# Altium schematic sheet MC_LV.SchDoc
size A2; SheetNumber: 1; SheetTotal: 1
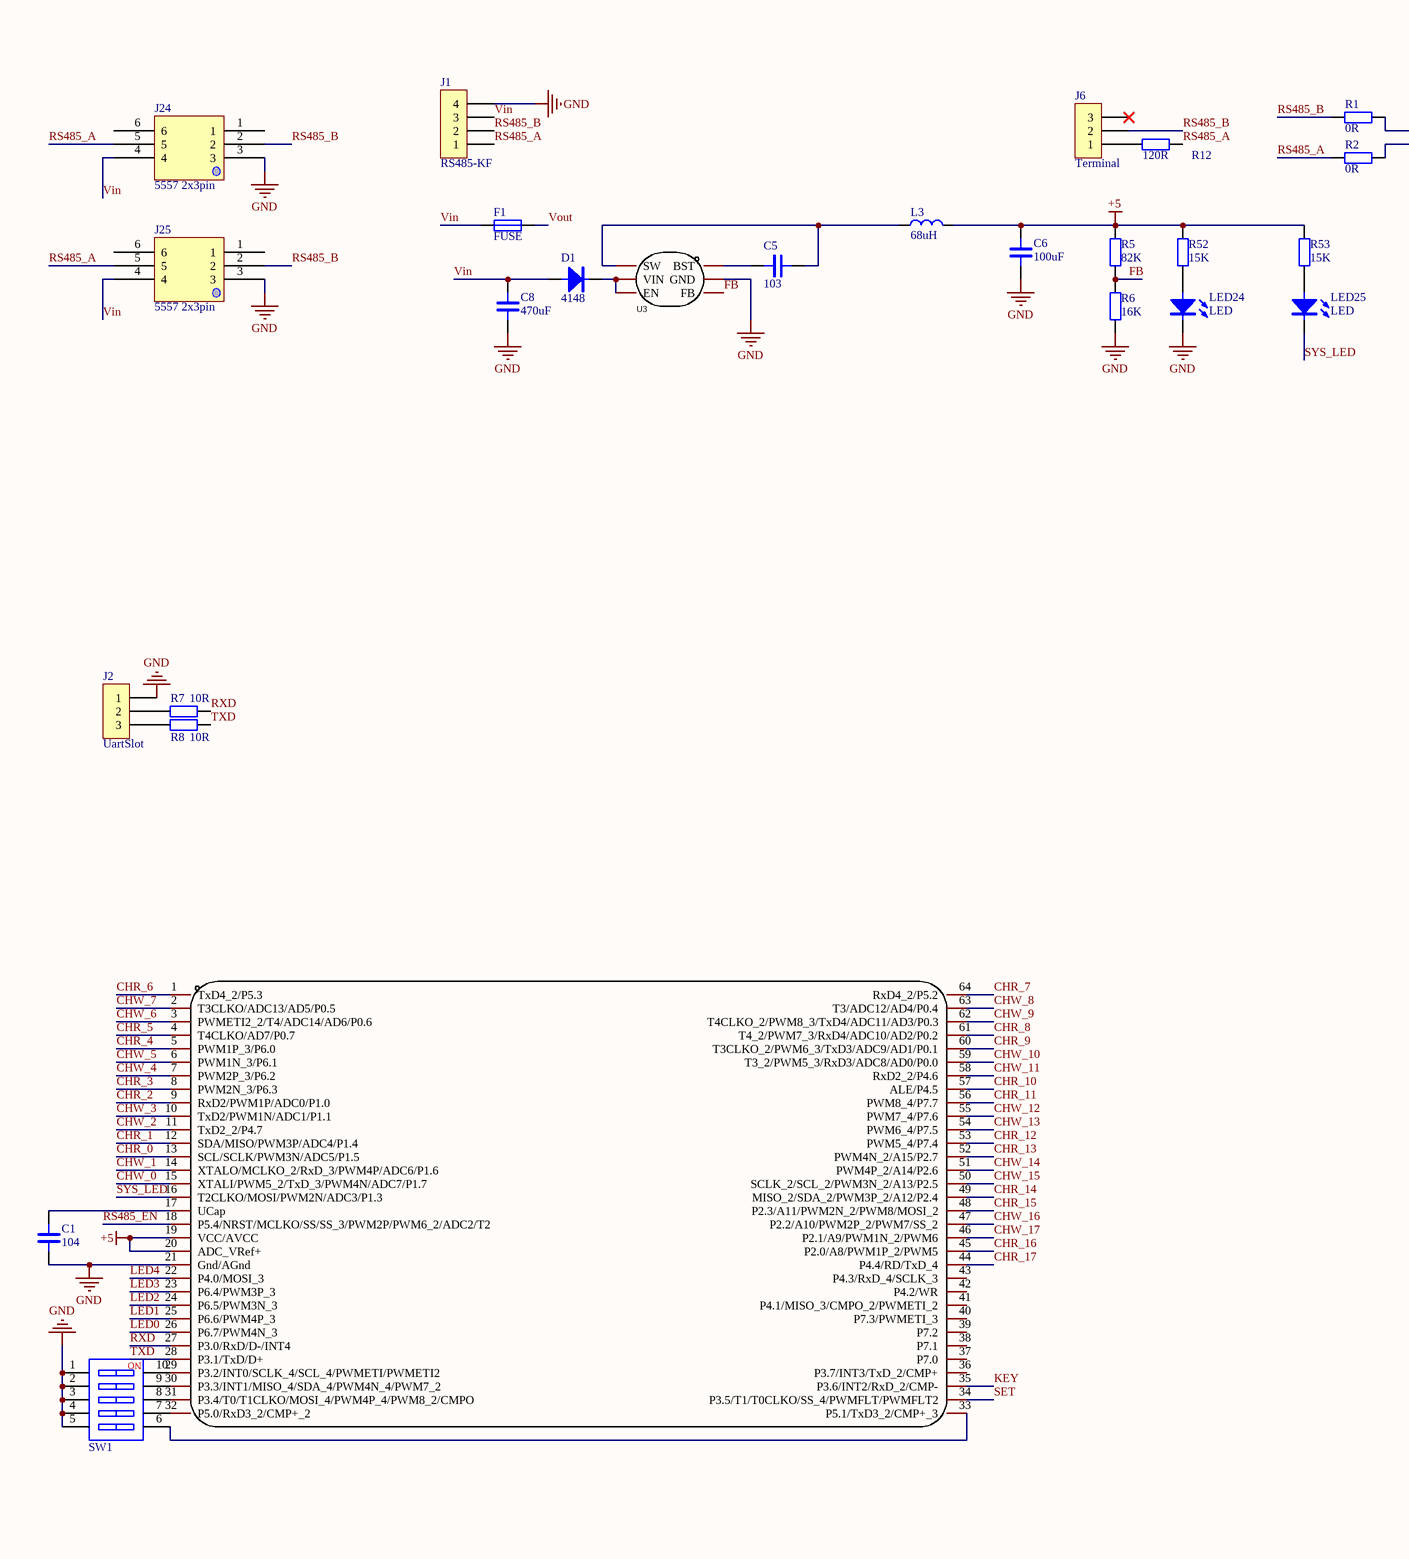
[diagram p0: MC_LV.SchDoc, left]
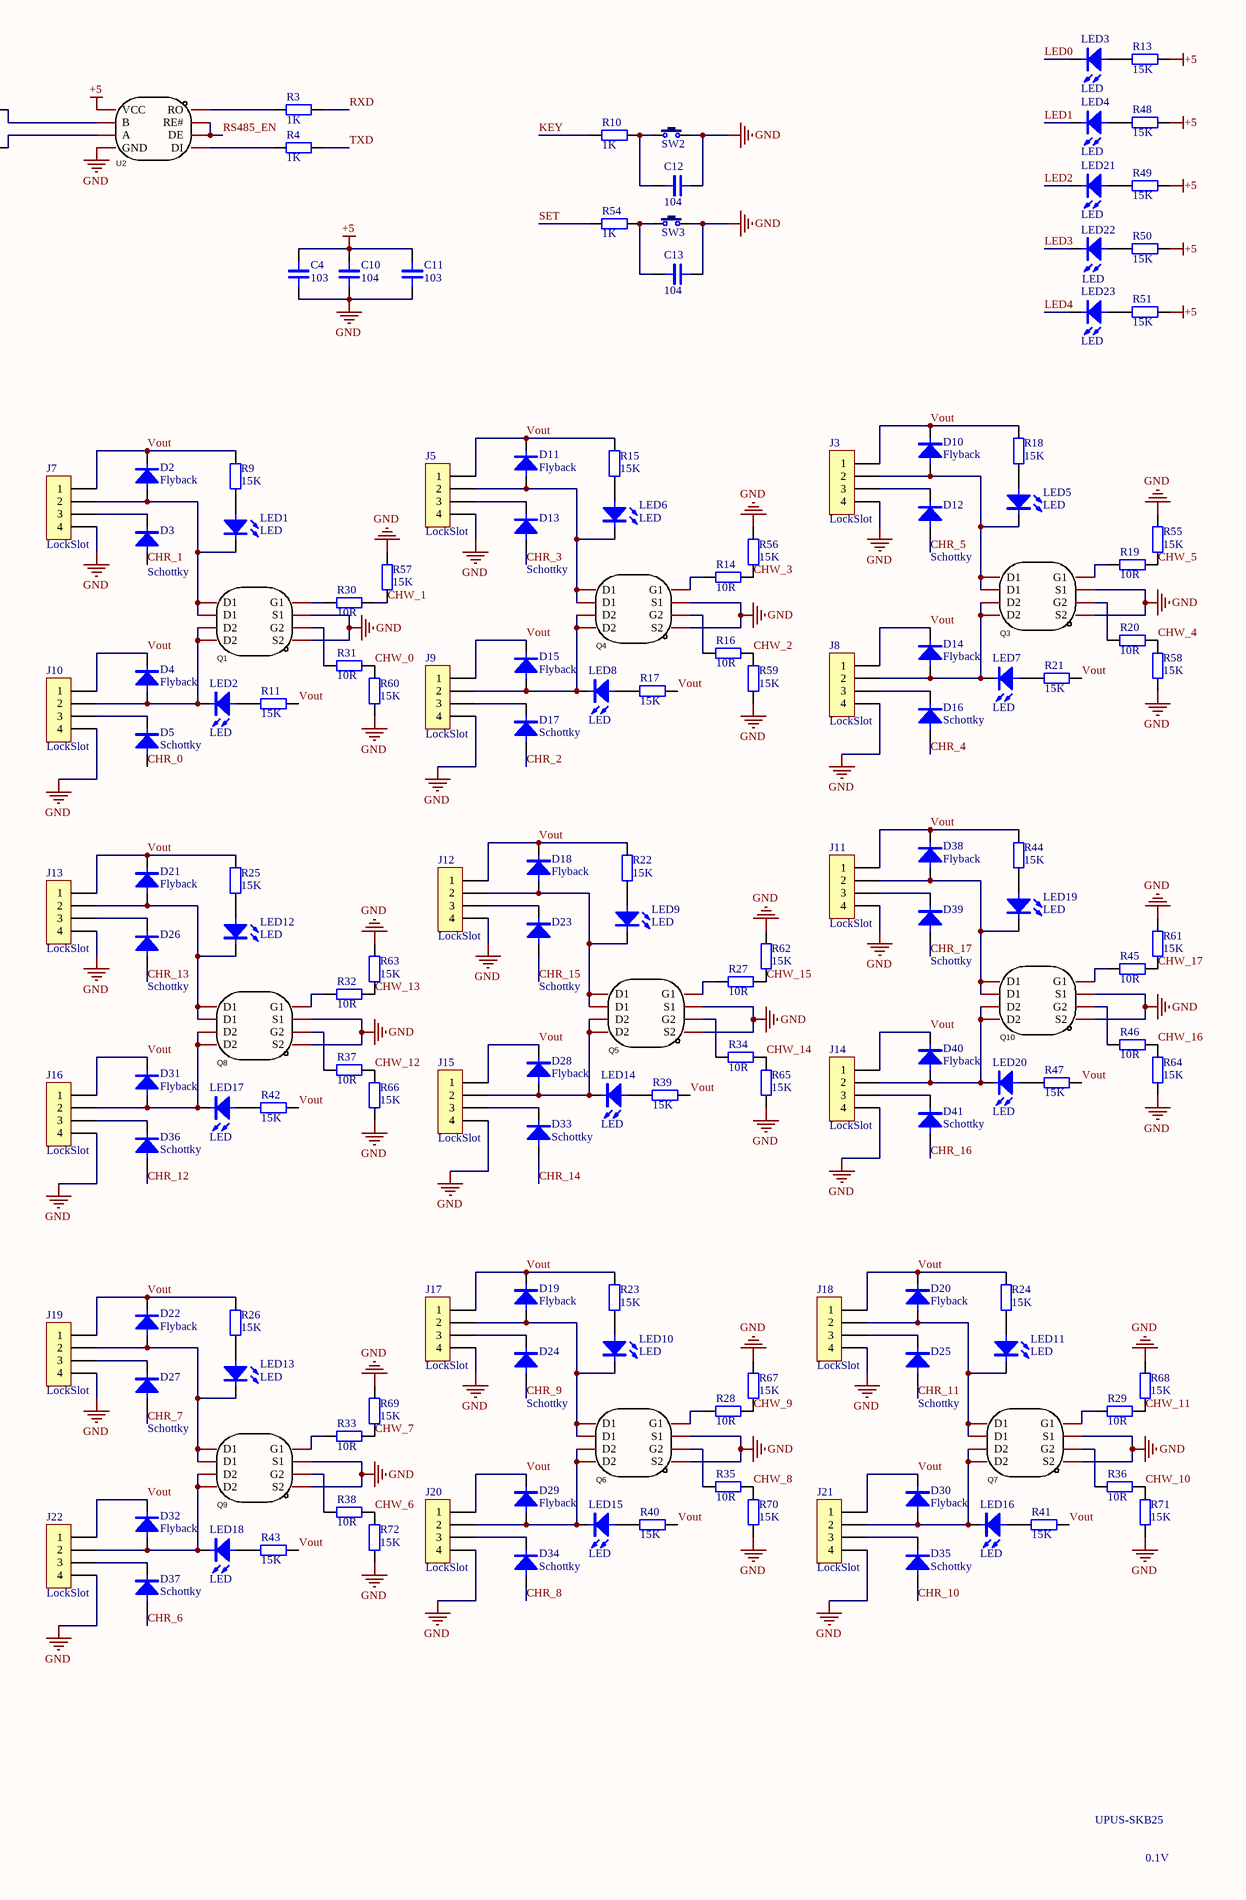
[diagram p1: MC_LV.SchDoc, right]

## Parts
C1  104  [LC-0603_C]
C4  103  [LC-0603_C]
C5  103  [LC-0603_C]
C6  100uF  [LC-1206_C]
C8  470uF  [CM F(10*10.2)]
C10  104  [LC-0603_C]
C11  103  [LC-0603_C]
C12  104  [LC-0603_C]
C13  104  [LC-0603_C]
D1  4148  [MINI_MELF (LL34)]
D2  Flyback  [SOD-123F]
D3  Schottky  [LC-SOD-523]
D4  Flyback  [SOD-123F]
D5  Schottky  [LC-SOD-523]
D10  Flyback  [SOD-123F]
D11  Flyback  [SOD-123F]
D12  Schottky  [LC-SOD-523]
D13  Schottky  [LC-SOD-523]
D14  Flyback  [SOD-123F]
D15  Flyback  [SOD-123F]
D16  Schottky  [LC-SOD-523]
D17  Schottky  [LC-SOD-523]
D18  Flyback  [SOD-123F]
D19  Flyback  [SOD-123F]
D20  Flyback  [SOD-123F]
D21  Flyback  [SOD-123F]
D22  Flyback  [SOD-123F]
D23  Schottky  [LC-SOD-523]
D24  Schottky  [LC-SOD-523]
D25  Schottky  [LC-SOD-523]
D26  Schottky  [LC-SOD-523]
D27  Schottky  [LC-SOD-523]
D28  Flyback  [SOD-123F]
D29  Flyback  [SOD-123F]
D30  Flyback  [SOD-123F]
D31  Flyback  [SOD-123F]
D32  Flyback  [SOD-123F]
D33  Schottky  [LC-SOD-523]
D34  Schottky  [LC-SOD-523]
D35  Schottky  [LC-SOD-523]
D36  Schottky  [LC-SOD-523]
D37  Schottky  [LC-SOD-523]
D38  Flyback  [SOD-123F]
D39  Schottky  [LC-SOD-523]
D40  Flyback  [SOD-123F]
D41  Schottky  [LC-SOD-523]
F1  FUSE  [FUSE-1812]
J1  RS485-KF  [KF128-5.08-4P]
J2  UartSlot  [XH2.54-3P]
J3  LockSlot  [XH2.54-4P]
J5  LockSlot  [XH2.54-4P]
J6  Terminal  [PIN-3-2.54-1.0]
J7  LockSlot  [XH2.54-4P]
J8  LockSlot  [XH2.54-4P]
J9  LockSlot  [XH2.54-4P]
J10  LockSlot  [XH2.54-4P]
J11  LockSlot  [XH2.54-4P]
J12  LockSlot  [XH2.54-4P]
J13  LockSlot  [XH2.54-4P]
J14  LockSlot  [XH2.54-4P]
J15  LockSlot  [XH2.54-4P]
J16  LockSlot  [XH2.54-4P]
J17  LockSlot  [XH2.54-4P]
J18  LockSlot  [XH2.54-4P]
J19  LockSlot  [XH2.54-4P]
J20  LockSlot  [XH2.54-4P]
J21  LockSlot  [XH2.54-4P]
J22  LockSlot  [XH2.54-4P]
J24  5557 2x3pin  [5557 2x3pin]
J25  5557 2x3pin  [5557 2x3pin]
L3  68uH  [CD32]
LED1  LED  [LED 0603B]
LED2  LED  [LED 0603B]
LED3  LED  [LED 0603B]
LED4  LED  [LED 0603B]
LED5  LED  [LED 0603B]
LED6  LED  [LED 0603B]
LED7  LED  [LED 0603B]
LED8  LED  [LED 0603B]
LED9  LED  [LED 0603B]
LED10  LED  [LED 0603B]
LED11  LED  [LED 0603B]
LED12  LED  [LED 0603B]
LED13  LED  [LED 0603B]
LED14  LED  [LED 0603B]
LED15  LED  [LED 0603B]
LED16  LED  [LED 0603B]
LED17  LED  [LED 0603B]
LED18  LED  [LED 0603B]
LED19  LED  [LED 0603B]
LED20  LED  [LED 0603B]
LED21  LED  [LED 0603B]
LED22  LED  [LED 0603B]
LED23  LED  [LED 0603B]
LED24  LED  [LED 0603B]
LED25  LED  [LED 0603B]
Q1  NCE6005AS  [SOP8_N]  (value not drawn)
Q3  NCE6005AS  [SOP8_N]  (value not drawn)
Q4  NCE6005AS  [SOP8_N]  (value not drawn)
Q5  NCE6005AS  [SOP8_N]  (value not drawn)
Q6  NCE6005AS  [SOP8_N]  (value not drawn)
Q7  NCE6005AS  [SOP8_N]  (value not drawn)
Q8  NCE6005AS  [SOP8_N]  (value not drawn)
Q9  NCE6005AS  [SOP8_N]  (value not drawn)
Q10  NCE6005AS  [SOP8_N]  (value not drawn)
R1  0R  [LC-0603_R]
R2  0R  [LC-0603_R]
R3  1K  [LC-0603_R]
R4  1K  [LC-0603_R]
R5  82K  [LC-0603_R]
R6  16K  [LC-0603_R]
R7  10R  [LC-0603_R]
R8  10R  [LC-0603_R]
R9  15K  [LC-0603_R]
R10  1K  [LC-0603_R]
R11  15K  [LC-0603_R]
R12  120R  [LC-0603_R]
R13  15K  [LC-0603_R]
R14  10R  [LC-0603_R]
R15  15K  [LC-0603_R]
R16  10R  [LC-0603_R]
R17  15K  [LC-0603_R]
R18  15K  [LC-0603_R]
R19  10R  [LC-0603_R]
R20  10R  [LC-0603_R]
R21  15K  [LC-0603_R]
R22  15K  [LC-0603_R]
R23  15K  [LC-0603_R]
R24  15K  [LC-0603_R]
R25  15K  [LC-0603_R]
R26  15K  [LC-0603_R]
R27  10R  [LC-0603_R]
R28  10R  [LC-0603_R]
R29  10R  [LC-0603_R]
R30  10R  [LC-0603_R]
R31  10R  [LC-0603_R]
R32  10R  [LC-0603_R]
R33  10R  [LC-0603_R]
R34  10R  [LC-0603_R]
R35  10R  [LC-0603_R]
R36  10R  [LC-0603_R]
R37  10R  [LC-0603_R]
R38  10R  [LC-0603_R]
R39  15K  [LC-0603_R]
R40  15K  [LC-0603_R]
R41  15K  [LC-0603_R]
R42  15K  [LC-0603_R]
R43  15K  [LC-0603_R]
R44  15K  [LC-0603_R]
R45  10R  [LC-0603_R]
R46  10R  [LC-0603_R]
R47  15K  [LC-0603_R]
R48  15K  [LC-0603_R]
R49  15K  [LC-0603_R]
R50  15K  [LC-0603_R]
R51  15K  [LC-0603_R]
R52  15K  [LC-0603_R]
R53  15K  [LC-0603_R]
R54  1K  [LC-0603_R]
R55  15K  [LC-0603_R]
R56  15K  [LC-0603_R]
R57  15K  [LC-0603_R]
R58  15K  [LC-0603_R]
R59  15K  [LC-0603_R]
R60  15K  [LC-0603_R]
R61  15K  [LC-0603_R]
R62  15K  [LC-0603_R]
R63  15K  [LC-0603_R]
R64  15K  [LC-0603_R]
R65  15K  [LC-0603_R]
R66  15K  [LC-0603_R]
R67  15K  [LC-0603_R]
R68  15K  [LC-0603_R]
R69  15K  [LC-0603_R]
R70  15K  [LC-0603_R]
R71  15K  [LC-0603_R]
R72  15K  [LC-0603_R]
SW1  CSW-5P  [SMD-5KEY]  (value not drawn)
SW2  3x6x5  [TSW SMD-3*6*2.5]  (value not drawn)
SW3  3x6x5  [TSW SMD-3*6*2.5]  (value not drawn)
U1  STC8H8K64U-45I-LQFP64_C3013146  [LQFP64 10x10_N]  (value not drawn)
U2  YD3082EESA  [SOP8_N]  (value not drawn)
U3  LGS5145  [SOT23-6L]  (value not drawn)

## Nets
+5: C4.1 C6.1 C10.1 C11.1 L3.2 R5.2 R13.2 R48.2 R49.2 R50.2 R51.2 R52.2 R53.2 U1.19(VCC/AVCC) U1.20(ADC_VRef+) U2.8(VCC)
GND: C1.2 C4.2 C6.2 C8.2 C10.2 C11.2 C12.2 C13.2 J1.4 J2.1 J3.4 J5.4 J7.4 J8.4 J9.4 J10.4 J11.4 J12.4 J13.4 J14.4 J15.4 J16.4 J17.4 J18.4 J19.4 J20.4 J21.4 J22.4 J24.3 J25.3 LED24.2(C) Q1.1(S2) Q1.3(S1) Q3.1(S2) Q3.3(S1) Q4.1(S2) Q4.3(S1) Q5.1(S2) Q5.3(S1) Q6.1(S2) Q6.3(S1) Q7.1(S2) Q7.3(S1) Q8.1(S2) Q8.3(S1) Q9.1(S2) Q9.3(S1) Q10.1(S2) Q10.3(S1) R6.1 R55.1 R56.1 R57.1 R58.1 R59.1 R60.1 R61.1 R62.1 R63.1 R64.1 R65.1 R66.1 R67.1 R68.1 R69.1 R70.1 R71.1 R72.1 SW1.1 SW1.2 SW1.3 SW1.4 SW1.5 SW2.1 SW3.1 U1.21(Gnd/AGnd) U2.5(GND) U3.2(GND)
CHR_0: D5.1(A) U1.13(SCL/SCLK/PWM3N/ADC5/P1.5)
CHR_1: D3.1(A) U1.12(SDA/MISO/PWM3P/ADC4/P1.4)
CHR_2: D17.1(A) U1.9(RxD2/PWM1P/ADC0/P1.0)
CHR_3: D13.1(A) U1.8(PWM2N_3/P6.3)
CHR_4: D16.1(A) U1.5(PWM1P_3/P6.0)
CHR_5: D12.1(A) U1.4(T4CLKO/AD7/P0.7)
CHR_6: D37.1(A) U1.1(TxD4_2/P5.3)
CHR_7: D27.1(A) U1.64(RxD4_2/P5.2)
CHR_8: D34.1(A) U1.61(T4_2/PWM7_3/RxD4/ADC10/AD2/P0.2)
CHR_9: D24.1(A) U1.60(T3CLKO_2/PWM6_3/TxD3/ADC9/AD1/P0.1)
CHR_10: D35.1(A) U1.57(ALE/P4.5)
CHR_11: D25.1(A) U1.56(PWM8_4/P7.7)
CHR_12: D36.1(A) U1.53(PWM5_4/P7.4)
CHR_13: D26.1(A) U1.52(PWM4N_2/A15/P2.7)
CHR_14: D33.1(A) U1.49(MISO_2/SDA_2/PWM3P_2/A12/P2.4)
CHR_15: D23.1(A) U1.48(P2.3/A11/PWM2N_2/PWM8/MOSI_2)
CHR_16: D41.1(A) U1.45(P2.0/A8/PWM1P_2/PWM5)
CHR_17: D39.1(A) U1.44(P4.4/RD/TxD_4)
CHW_0: R31.2 R60.2 U1.15(XTALI/PWM5_2/TxD_3/PWM4N/ADC7/P1.7)
CHW_1: R30.1 R57.2 U1.14(XTALO/MCLKO_2/RxD_3/PWM4P/ADC6/P1.6)
CHW_2: R16.1 R59.2 U1.11(TxD2_2/P4.7)
CHW_3: R14.1 R56.2 U1.10(TxD2/PWM1N/ADC1/P1.1)
CHW_4: R20.1 R58.2 U1.7(PWM2P_3/P6.2)
CHW_5: R19.1 R55.2 U1.6(PWM1N_3/P6.1)
CHW_6: R38.1 R72.2 U1.3(PWMETI2_2/T4/ADC14/AD6/P0.6)
CHW_7: R33.1 R69.2 U1.2(T3CLKO/ADC13/AD5/P0.5)
CHW_8: R35.1 R70.2 U1.63(T3/ADC12/AD4/P0.4)
CHW_9: R28.1 R67.2 U1.62(T4CLKO_2/PWM8_3/TxD4/ADC11/AD3/P0.3)
CHW_10: R36.1 R71.2 U1.59(T3_2/PWM5_3/RxD3/ADC8/AD0/P0.0)
CHW_11: R29.1 R68.2 U1.58(RxD2_2/P4.6)
CHW_12: R37.1 R66.2 U1.55(PWM7_4/P7.6)
CHW_13: R32.1 R63.2 U1.54(PWM6_4/P7.5)
CHW_14: R34.1 R65.2 U1.51(PWM4P_2/A14/P2.6)
CHW_15: R27.1 R62.2 U1.50(SCLK_2/SCL_2/PWM3N_2/A13/P2.5)
CHW_16: R46.1 R64.2 U1.47(P2.2/A10/PWM2P_2/PWM7/SS_2)
CHW_17: R45.1 R61.2 U1.46(P2.1/A9/PWM1N_2/PWM6)
FB: R5.1 R6.2 U3.3(FB)
KEY: R10.2 U1.35(P3.6/INT2/RxD_2/CMP-)
LED0: LED3.2(C) U1.26(P6.7/PWM4N_3)
LED1: LED4.2(C) U1.25(P6.6/PWM4P_3)
LED2: LED21.2(C) U1.24(P6.5/PWM3N_3)
LED3: LED22.2(C) U1.23(P6.4/PWM3P_3)
LED4: LED23.2(C) U1.22(P4.0/MOSI_3)
RS485_A: J1.1 J24.5 J25.5 R2.1 R12.1
RS485_B: J1.2 J6.2 J24.2 J25.2 R1.1
RS485_EN: U1.18(P5.4/NRST/MCLKO/SS/SS_3/PWM2P/PWM6_2/ADC2/T2) U2.2(RE#) U2.3(DE)
RXD: R3.2 R7.2 U1.27(P3.0/RxD/D-/INT4)
SET: R54.2 U1.34(P3.5/T1/T0CLKO/SS_4/PWMFLT/PWMFLT2)
SYS_LED: LED25.2(C) U1.16(T2CLKO/MOSI/PWM2N/ADC3/P1.3)
TXD: R4.2 R8.2 U1.28(P3.1/TxD/D+)
Vin: C8.1 D1.1(A) F1.1 J1.3 J24.4 J25.4
Vout: D2.2(C) D4.2(C) D10.2(C) D11.2(C) D14.2(C) D15.2(C) D18.2(C) D19.2(C) D20.2(C) D21.2(C) D22.2(C) D28.2(C) D29.2(C) D30.2(C) D31.2(C) D32.2(C) D38.2(C) D40.2(C) F1.2 J3.1 J5.1 J7.1 J8.1 J9.1 J10.1 J11.1 J12.1 J13.1 J14.1 J15.1 J16.1 J17.1 J18.1 J19.1 J20.1 J21.1 J22.1 R9.2 R11.2 R15.2 R17.2 R18.2 R21.2 R22.2 R23.2 R24.2 R25.2 R26.2 R39.2 R40.2 R41.2 R42.2 R43.2 R44.2 R47.2
NetC1_1: C1.1 U1.17(UCap)
NetC5_1: C5.1 L3.1 U3.6(SW)
NetC5_2: C5.2 U3.1(BST)
NetC12_1: C12.1 R10.1 SW2.2
NetC13_1: C13.1 R54.1 SW3.2
NetD1_2: D1.2(C) U3.4(EN) U3.5(VIN)
NetD2_1: D2.1(A) J7.2 LED1.2(C) Q1.5(D1) Q1.6(D1)
NetD3_2: D3.2(C) J7.3
NetD4_1: D4.1(A) J10.2 LED2.2(C) Q1.7(D2) Q1.8(D2)
NetD5_2: D5.2(C) J10.3
NetD10_1: D10.1(A) J3.2 LED5.2(C) Q3.5(D1) Q3.6(D1)
NetD11_1: D11.1(A) J5.2 LED6.2(C) Q4.5(D1) Q4.6(D1)
NetD12_2: D12.2(C) J3.3
NetD13_2: D13.2(C) J5.3
NetD14_1: D14.1(A) J8.2 LED7.2(C) Q3.7(D2) Q3.8(D2)
NetD15_1: D15.1(A) J9.2 LED8.2(C) Q4.7(D2) Q4.8(D2)
NetD16_2: D16.2(C) J8.3
NetD17_2: D17.2(C) J9.3
NetD18_1: D18.1(A) J12.2 LED9.2(C) Q5.5(D1) Q5.6(D1)
NetD19_1: D19.1(A) J17.2 LED10.2(C) Q6.5(D1) Q6.6(D1)
NetD20_1: D20.1(A) J18.2 LED11.2(C) Q7.5(D1) Q7.6(D1)
NetD21_1: D21.1(A) J13.2 LED12.2(C) Q8.5(D1) Q8.6(D1)
NetD22_1: D22.1(A) J19.2 LED13.2(C) Q9.5(D1) Q9.6(D1)
NetD23_2: D23.2(C) J12.3
NetD24_2: D24.2(C) J17.3
NetD25_2: D25.2(C) J18.3
NetD26_2: D26.2(C) J13.3
NetD27_2: D27.2(C) J19.3
NetD28_1: D28.1(A) J15.2 LED14.2(C) Q5.7(D2) Q5.8(D2)
NetD29_1: D29.1(A) J20.2 LED15.2(C) Q6.7(D2) Q6.8(D2)
NetD30_1: D30.1(A) J21.2 LED16.2(C) Q7.7(D2) Q7.8(D2)
NetD31_1: D31.1(A) J16.2 LED17.2(C) Q8.7(D2) Q8.8(D2)
NetD32_1: D32.1(A) J22.2 LED18.2(C) Q9.7(D2) Q9.8(D2)
NetD33_2: D33.2(C) J15.3
NetD34_2: D34.2(C) J20.3
NetD35_2: D35.2(C) J21.3
NetD36_2: D36.2(C) J16.3
NetD37_2: D37.2(C) J22.3
NetD38_1: D38.1(A) J11.2 LED19.2(C) Q10.5(D1) Q10.6(D1)
NetD39_2: D39.2(C) J11.3
NetD40_1: D40.1(A) J14.2 LED20.2(C) Q10.7(D2) Q10.8(D2)
NetD41_2: D41.2(C) J14.3
NetJ2_2: J2.2 R7.1
NetJ2_3: J2.3 R8.1
NetJ6_1: J6.1 R12.2
NetLED1_1: LED1.1(A) R9.1
NetLED2_1: LED2.1(A) R11.1
NetLED3_1: LED3.1(A) R13.1
NetLED4_1: LED4.1(A) R48.1
NetLED5_1: LED5.1(A) R18.1
NetLED6_1: LED6.1(A) R15.1
NetLED7_1: LED7.1(A) R21.1
NetLED8_1: LED8.1(A) R17.1
NetLED9_1: LED9.1(A) R22.1
NetLED10_1: LED10.1(A) R23.1
NetLED11_1: LED11.1(A) R24.1
NetLED12_1: LED12.1(A) R25.1
NetLED13_1: LED13.1(A) R26.1
NetLED14_1: LED14.1(A) R39.1
NetLED15_1: LED15.1(A) R40.1
NetLED16_1: LED16.1(A) R41.1
NetLED17_1: LED17.1(A) R42.1
NetLED18_1: LED18.1(A) R43.1
NetLED19_1: LED19.1(A) R44.1
NetLED20_1: LED20.1(A) R47.1
NetLED21_1: LED21.1(A) R49.1
NetLED22_1: LED22.1(A) R50.1
NetLED23_1: LED23.1(A) R51.1
NetLED24_1: LED24.1(A) R52.1
NetLED25_1: LED25.1(A) R53.1
NetQ1_2: Q1.2(G2) R31.1
NetQ1_4: Q1.4(G1) R30.2
NetQ3_2: Q3.2(G2) R20.2
NetQ3_4: Q3.4(G1) R19.2
NetQ4_2: Q4.2(G2) R16.2
NetQ4_4: Q4.4(G1) R14.2
NetQ5_2: Q5.2(G2) R34.2
NetQ5_4: Q5.4(G1) R27.2
NetQ6_2: Q6.2(G2) R35.2
NetQ6_4: Q6.4(G1) R28.2
NetQ7_2: Q7.2(G2) R36.2
NetQ7_4: Q7.4(G1) R29.2
NetQ8_2: Q8.2(G2) R37.2
NetQ8_4: Q8.4(G1) R32.2
NetQ9_2: Q9.2(G2) R38.2
NetQ9_4: Q9.4(G1) R33.2
NetQ10_2: Q10.2(G2) R46.2
NetQ10_4: Q10.4(G1) R45.2
NetR1_2: R1.2 U2.7(B)
NetR2_2: R2.2 U2.6(A)
NetR3_1: R3.1 U2.1(RO)
NetR4_1: R4.1 U2.4(DI)
NetSW1_6: SW1.6 U1.33(P5.1/TxD3_2/CMP+_3)
NetSW1_7: SW1.7 U1.32(P5.0/RxD3_2/CMP+_2)
NetSW1_8: SW1.8 U1.31(P3.4/T0/T1CLKO/MOSI_4/PWM4P_4/PWM8_2/CMPO)
NetSW1_9: SW1.9 U1.30(P3.3/INT1/MISO_4/SDA_4/PWM4N_4/PWM7_2)
NetSW1_10: SW1.10 U1.29(P3.2/INT0/SCLK_4/SCL_4/PWMETI/PWMETI2)

Not connected (* = marked no-connect by the designer): J6 3*; J24 1 6; J25 1 6; U1 36(P3.7/INT3/TxD_2/CMP+) 37(P7.0) 38(P7.1) 39(P7.2) 40(P7.3/PWMETI_3) 41(P4.1/MISO_3/CMPO_2/PWMETI_2) 42(P4.2/WR) 43(P4.3/RxD_4/SCLK_3)

## Notes on the sheet
- UPUS-SKB25
- 0.1V
- (in symbol CSW-5P) NO

## Library data of the parts
C1 C4-C6 C8 C10-C13 = CAP: Capacitor
D1-D5 D10-D41 = ES2x: Diode
F1 = FUSE: 30V 3A
J1 J3 J5 J7-J22 = HDR1x4: Connector
J2 J6 = HDR1x3: Connector
L3 = INDUCTANCE
Q1 Q3-Q10 = NCE6005AS: Mosfet; Manufacturer: NCE(无锡新洁能); Add into BOM: yes; Type: 2个N沟道; Drain Source Voltage (Vdss): 60V; Continuous Drain Current (Id): 5A; Power Dissipation (Pd): 2W; Drain Source On Resistance (RDS(on)@Vgs,Id): 35mΩ@10V,5A; Gate Threshold Voltage (Vgs(th)@Id): 2.5V@250uA; Name: NCE6005AS; Symbol: NCE6005AS; Device: NCE6005AS; LCSC Part Name: 2个N沟道 60V 5A; Supplier Part: C126151; Manufacturer Part: NCE6005AS; Supplier Footprint: SOP-8; JLCPCB Part Class: Extended Part; Datasheet: https://atta.szlcsc.com/upload/public/pdf/source/20170818/C126151_1503051224272895226.pdf; Supplier: LCSC; Convert to PCB: yes
R1-R72 = RES: Resistor
SW1 = CSW-5P: 5路编码开关; 版权归属: 源创客; BOM名称: 5路编码开关; 学习资源: www.ooocke.com
SW2 SW3 = TSW 3x6: 3x6轻触开关; 版权归属: 源创客; BOM名称: 3x6轻触开关; 学习资源: www.ooocke.com
U1 = STC8H8K64U-45I-LQFP64_C3013146: MCU; Manufacturer: STC(宏晶); Add into BOM: yes; Name: STC8H8K64U-45I-LQFP64; Symbol: STC8H8K64U-45I-LQFP64_C3013146; Device: STC8H8K64U-45I-LQFP64_C3013146; LCSC Part Name: STC8H8K64U-45I-LQFP64; Supplier Part: C3013146; Manufacturer Part: STC8H8K64U-45I-LQFP64; Supplier Footprint: LQFP-64; JLCPCB Part Class: Extended Part; Datasheet: https://atta.szlcsc.com/upload/public/pdf/source/20221202/0D10E8182E61F0F0D92AF265D506089B.pdf; Supplier: LCSC; Convert to PCB: yes
U2 = YD3082EESA: RS485 Controller; Manufacturer: GATEMODE(捷茂微); Add into BOM: yes; Types: 收发器; Driver/receiver: 1/1; Data Rate: 1Mbps; Supply Voltage: 3V~5.5V; Name: YD3082EESA; Symbol: YD3082E; Device: YD3082EESA; LCSC Part Name: 3V~5.5V供电 1Mbps 收发器; Supplier Part: C269866; Manufacturer Part: YD3082EESA; Supplier Footprint: SOP-8; JLCPCB Part Class: Extended Part; Datasheet: https://atta.szlcsc.com/upload/public/pdf/source/20200615/C269866_B61762A804B9C6870F11430C10969426.pdf; Supplier: LCSC; Convert to PCB: yes
U3 = LGS5145: DC-DC; Manufacturer: Legend-Si(棱晶半导体); Add into BOM: yes; Function: 降压型; Synchronous Rectification: 否; Output Type: 可调; Number of Outputs: 1; Topology: 降压式; Input Voltage: 4.5V~55V; Output Voltage: 800mV~40V; Output Current (Max): 1A; Switching Frequency: 1.2MHz; Quiescent Current (Iq): 150uA; Name: LGS5145; Symbol: LGS5145; Device: LGS5145; LCSC Part Name: 降压型 Vin=4.5V~55V Vout=800mV~40V 1A; Supplier Part: C5123971; Manufacturer Part: LGS5145; Supplier Footprint: SOT-23-6; JLCPCB Part Class: Extended Part; Datasheet: https://atta.szlcsc.com/upload/public/pdf/source/20230407/AF0D76B6B755358F740E4FC32952FD3E.pdf; Supplier: LCSC; Convert to PCB: yes; Operating Temperature: -40℃~+125℃@(TJ)